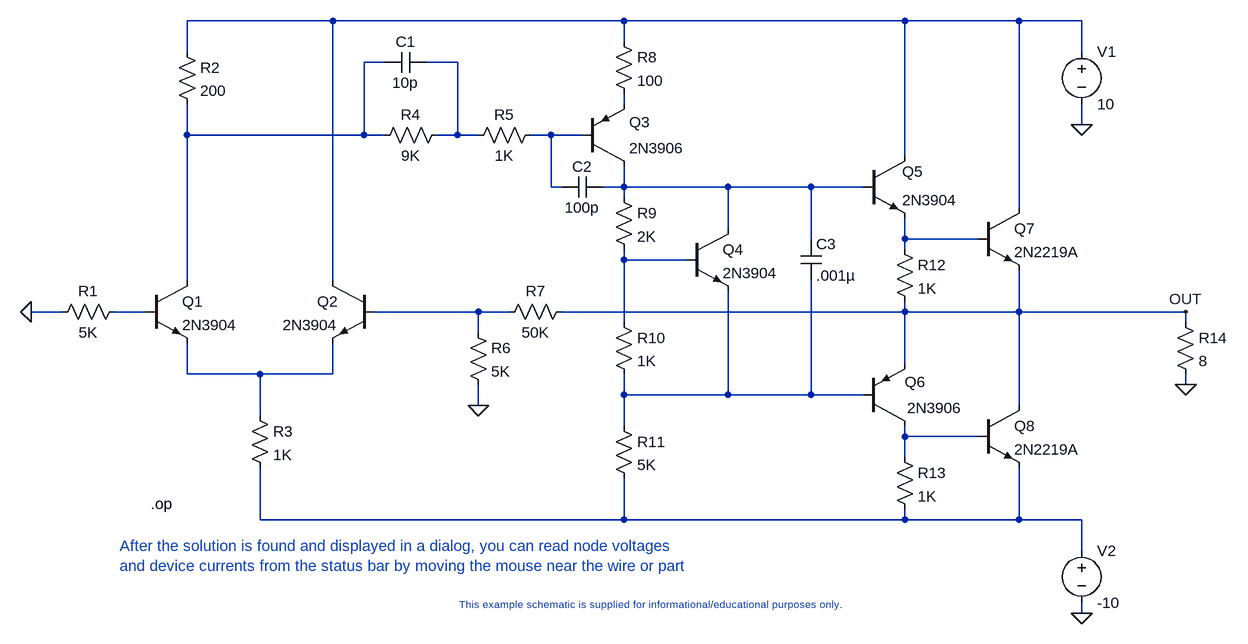
[diagram p0: schematic DCopPnt.asc]
DCopPnt.asc, the LTspice schematic file:
Version 4
SHEET 1 2352 1864
WIRE 944 912 720 912
WIRE 1392 912 944 912
WIRE 1824 912 1392 912
WIRE 2000 912 1824 912
WIRE 2096 912 2000 912
WIRE 1392 944 1392 912
WIRE 720 960 720 912
WIRE 2096 960 2096 912
WIRE 1024 976 992 976
WIRE 1136 976 1088 976
WIRE 1392 1040 1392 1024
WIRE 2096 1072 2096 1040
WIRE 720 1088 720 1040
WIRE 992 1088 992 976
WIRE 992 1088 720 1088
WIRE 1024 1088 992 1088
WIRE 1136 1088 1136 976
WIRE 1136 1088 1104 1088
WIRE 1168 1088 1136 1088
WIRE 1280 1088 1248 1088
WIRE 1328 1088 1280 1088
WIRE 1824 1120 1824 912
WIRE 1280 1168 1280 1088
WIRE 1296 1168 1280 1168
WIRE 1392 1168 1392 1136
WIRE 1392 1168 1360 1168
WIRE 1552 1168 1392 1168
WIRE 1680 1168 1552 1168
WIRE 1760 1168 1680 1168
WIRE 1392 1184 1392 1168
WIRE 2000 1200 2000 912
WIRE 1552 1232 1552 1168
WIRE 1680 1248 1680 1168
WIRE 1824 1248 1824 1216
WIRE 1936 1248 1824 1248
WIRE 1824 1264 1824 1248
WIRE 1392 1280 1392 1264
WIRE 1488 1280 1392 1280
WIRE 720 1312 720 1088
WIRE 944 1312 944 912
WIRE 528 1360 480 1360
WIRE 656 1360 608 1360
WIRE 1168 1360 1008 1360
WIRE 1216 1360 1168 1360
WIRE 1824 1360 1824 1344
WIRE 1824 1360 1296 1360
WIRE 2000 1360 2000 1296
WIRE 2000 1360 1824 1360
WIRE 2128 1360 2000 1360
WIRE 2256 1360 2128 1360
WIRE 1392 1376 1392 1280
WIRE 2256 1376 2256 1360
WIRE 1168 1392 1168 1360
WIRE 1824 1440 1824 1360
WIRE 720 1456 720 1408
WIRE 832 1456 720 1456
WIRE 944 1456 944 1408
WIRE 944 1456 832 1456
WIRE 2256 1472 2256 1456
WIRE 1392 1488 1392 1456
WIRE 1552 1488 1552 1328
WIRE 1552 1488 1392 1488
WIRE 1680 1488 1680 1312
WIRE 1680 1488 1552 1488
WIRE 1760 1488 1680 1488
WIRE 1168 1504 1168 1472
WIRE 2000 1504 2000 1360
WIRE 832 1520 832 1456
WIRE 1392 1536 1392 1488
WIRE 1824 1552 1824 1536
WIRE 1936 1552 1824 1552
WIRE 1824 1584 1824 1552
WIRE 832 1680 832 1600
WIRE 1392 1680 1392 1616
WIRE 1392 1680 832 1680
WIRE 1824 1680 1824 1664
WIRE 1824 1680 1392 1680
WIRE 2000 1680 2000 1600
WIRE 2000 1680 1824 1680
WIRE 2096 1680 2000 1680
WIRE 2096 1728 2096 1680
WIRE 2096 1824 2096 1808
FLAG 2096 1072 0
FLAG 2096 1824 0
FLAG 2256 1472 0
FLAG 1168 1504 0
FLAG 480 1360 0
FLAG 2256 1360 OUT
DATAFLAG 2128 1360 ""
SYMBOL NPN 1760 1120 R0
WINDOW 0 60 24 Left 2
WINDOW 3 60 68 Left 2
SYMATTR InstName Q5
SYMATTR Value 2N3904
SYMBOL npn 1936 1200 R0
SYMATTR InstName Q7
SYMATTR Value 2N2219A
SYMBOL npn 1936 1504 R0
SYMATTR InstName Q8
SYMATTR Value 2N2219A
SYMBOL PNP 1760 1536 M180
WINDOW 0 64 68 Left 2
WINDOW 3 68 28 Left 2
SYMATTR InstName Q6
SYMATTR Value 2N3906
SYMBOL VOLTAGE 2096 944 R0
SYMATTR InstName V1
SYMATTR Value 10
SYMBOL voltage 2096 1712 R0
SYMATTR InstName V2
SYMATTR Value -10
SYMBOL RES 1376 1520 R0
SYMATTR InstName R11
SYMATTR Value 5K
SYMBOL res 2240 1360 R0
SYMATTR InstName R14
SYMATTR Value 8
SYMBOL res 1376 1168 R0
SYMATTR InstName R9
SYMATTR Value 2K
SYMBOL res 1376 1360 R0
SYMATTR InstName R10
SYMATTR Value 1K
SYMBOL npn 1488 1232 R0
SYMATTR InstName Q4
SYMATTR Value 2N3904
SYMBOL npn 656 1312 R0
SYMATTR InstName Q1
SYMATTR Value 2N3904
SYMBOL npn 1008 1312 M0
SYMATTR InstName Q2
SYMATTR Value 2N3904
SYMBOL res 704 944 R0
SYMATTR InstName R2
SYMATTR Value 200
SYMBOL res 816 1504 R0
SYMATTR InstName R3
SYMATTR Value 1K
SYMBOL pnp 1328 1136 M180
WINDOW 0 72 68 Left 2
WINDOW 3 72 28 Left 2
SYMATTR InstName Q3
SYMATTR Value 2N3906
SYMBOL res 1152 1376 R0
SYMATTR InstName R6
SYMATTR Value 5K
SYMBOL res 1312 1344 R90
WINDOW 0 0 56 VBottom 2
WINDOW 3 32 56 VTop 2
SYMATTR InstName R7
SYMATTR Value 50K
SYMBOL res 624 1344 R90
WINDOW 0 0 56 VBottom 2
WINDOW 3 32 56 VTop 2
SYMATTR InstName R1
SYMATTR Value 5K
SYMBOL res 1376 928 R0
SYMATTR InstName R8
SYMATTR Value 100
SYMBOL res 1120 1072 R90
WINDOW 0 0 56 VBottom 2
WINDOW 3 32 56 VTop 2
SYMATTR InstName R4
SYMATTR Value 9K
SYMBOL cap 1360 1152 R90
WINDOW 0 0 32 VBottom 2
WINDOW 3 32 32 VTop 2
SYMATTR InstName C2
SYMATTR Value 100p
SYMBOL cap 1088 960 R90
WINDOW 0 0 32 VBottom 2
WINDOW 3 32 32 VTop 2
SYMATTR InstName C1
SYMATTR Value 10p
SYMBOL res 1808 1568 R0
SYMATTR InstName R13
SYMATTR Value 1K
SYMBOL res 1808 1248 R0
SYMATTR InstName R12
SYMATTR Value 1K
SYMBOL cap 1664 1248 R0
SYMATTR InstName C3
SYMATTR Value .001µ
SYMBOL res 1264 1072 R90
WINDOW 0 0 56 VBottom 2
WINDOW 3 32 56 VTop 2
SYMATTR InstName R5
SYMATTR Value 1K
TEXT 1424 1800 Top 1 ;This example schematic is supplied for informational/educational purposes only.
TEXT 664 1656 Left 2 !.op
TEXT 616 1720 Left 2 ;After the solution is found and displayed in a dialog, you can read node voltages\nand device currents from the status bar by moving the mouse near the wire or part

The netlist it stands for:
* DCopPnt.asc
Q5 N001 N006 N007 0 2N3904
Q7 N001 N007 OUT 0 2N2219A
Q8 OUT N013 N014 0 2N2219A
Q6 N013 N012 OUT 0 2N3906
V1 N001 0 10
V2 N014 0 -10
R11 N012 N014 5K
R14 OUT 0 8
R9 N006 N008 2K
R10 N008 N012 1K
Q4 N006 N008 N012 0 2N3904
Q1 N002 N009 N011 0 2N3904
Q2 N001 N010 N011 0 2N3904
R2 N001 N002 200
R3 N011 N014 1K
Q3 N006 N005 N004 0 2N3906
R6 N010 0 5K
R7 OUT N010 50K
R1 N009 0 5K
R8 N001 N004 100
R4 N003 N002 9K
C2 N006 N005 100p
C1 N003 N002 10p
R13 N013 N014 1K
R12 N007 OUT 1K
C3 N006 N012 .001µ
R5 N005 N003 1K
.model NPN NPN
.model PNP PNP
.lib standard.bjt
* This example schematic is supplied for informational/educational purposes only.
.op
* After the solution is found and displayed in a dialog, you can read node voltages
* and device currents from the status bar by moving the mouse near the wire or part
.backanno
.end